# Altium project RK_MEGAPLATA.PrjPcb (part 6 of 9)
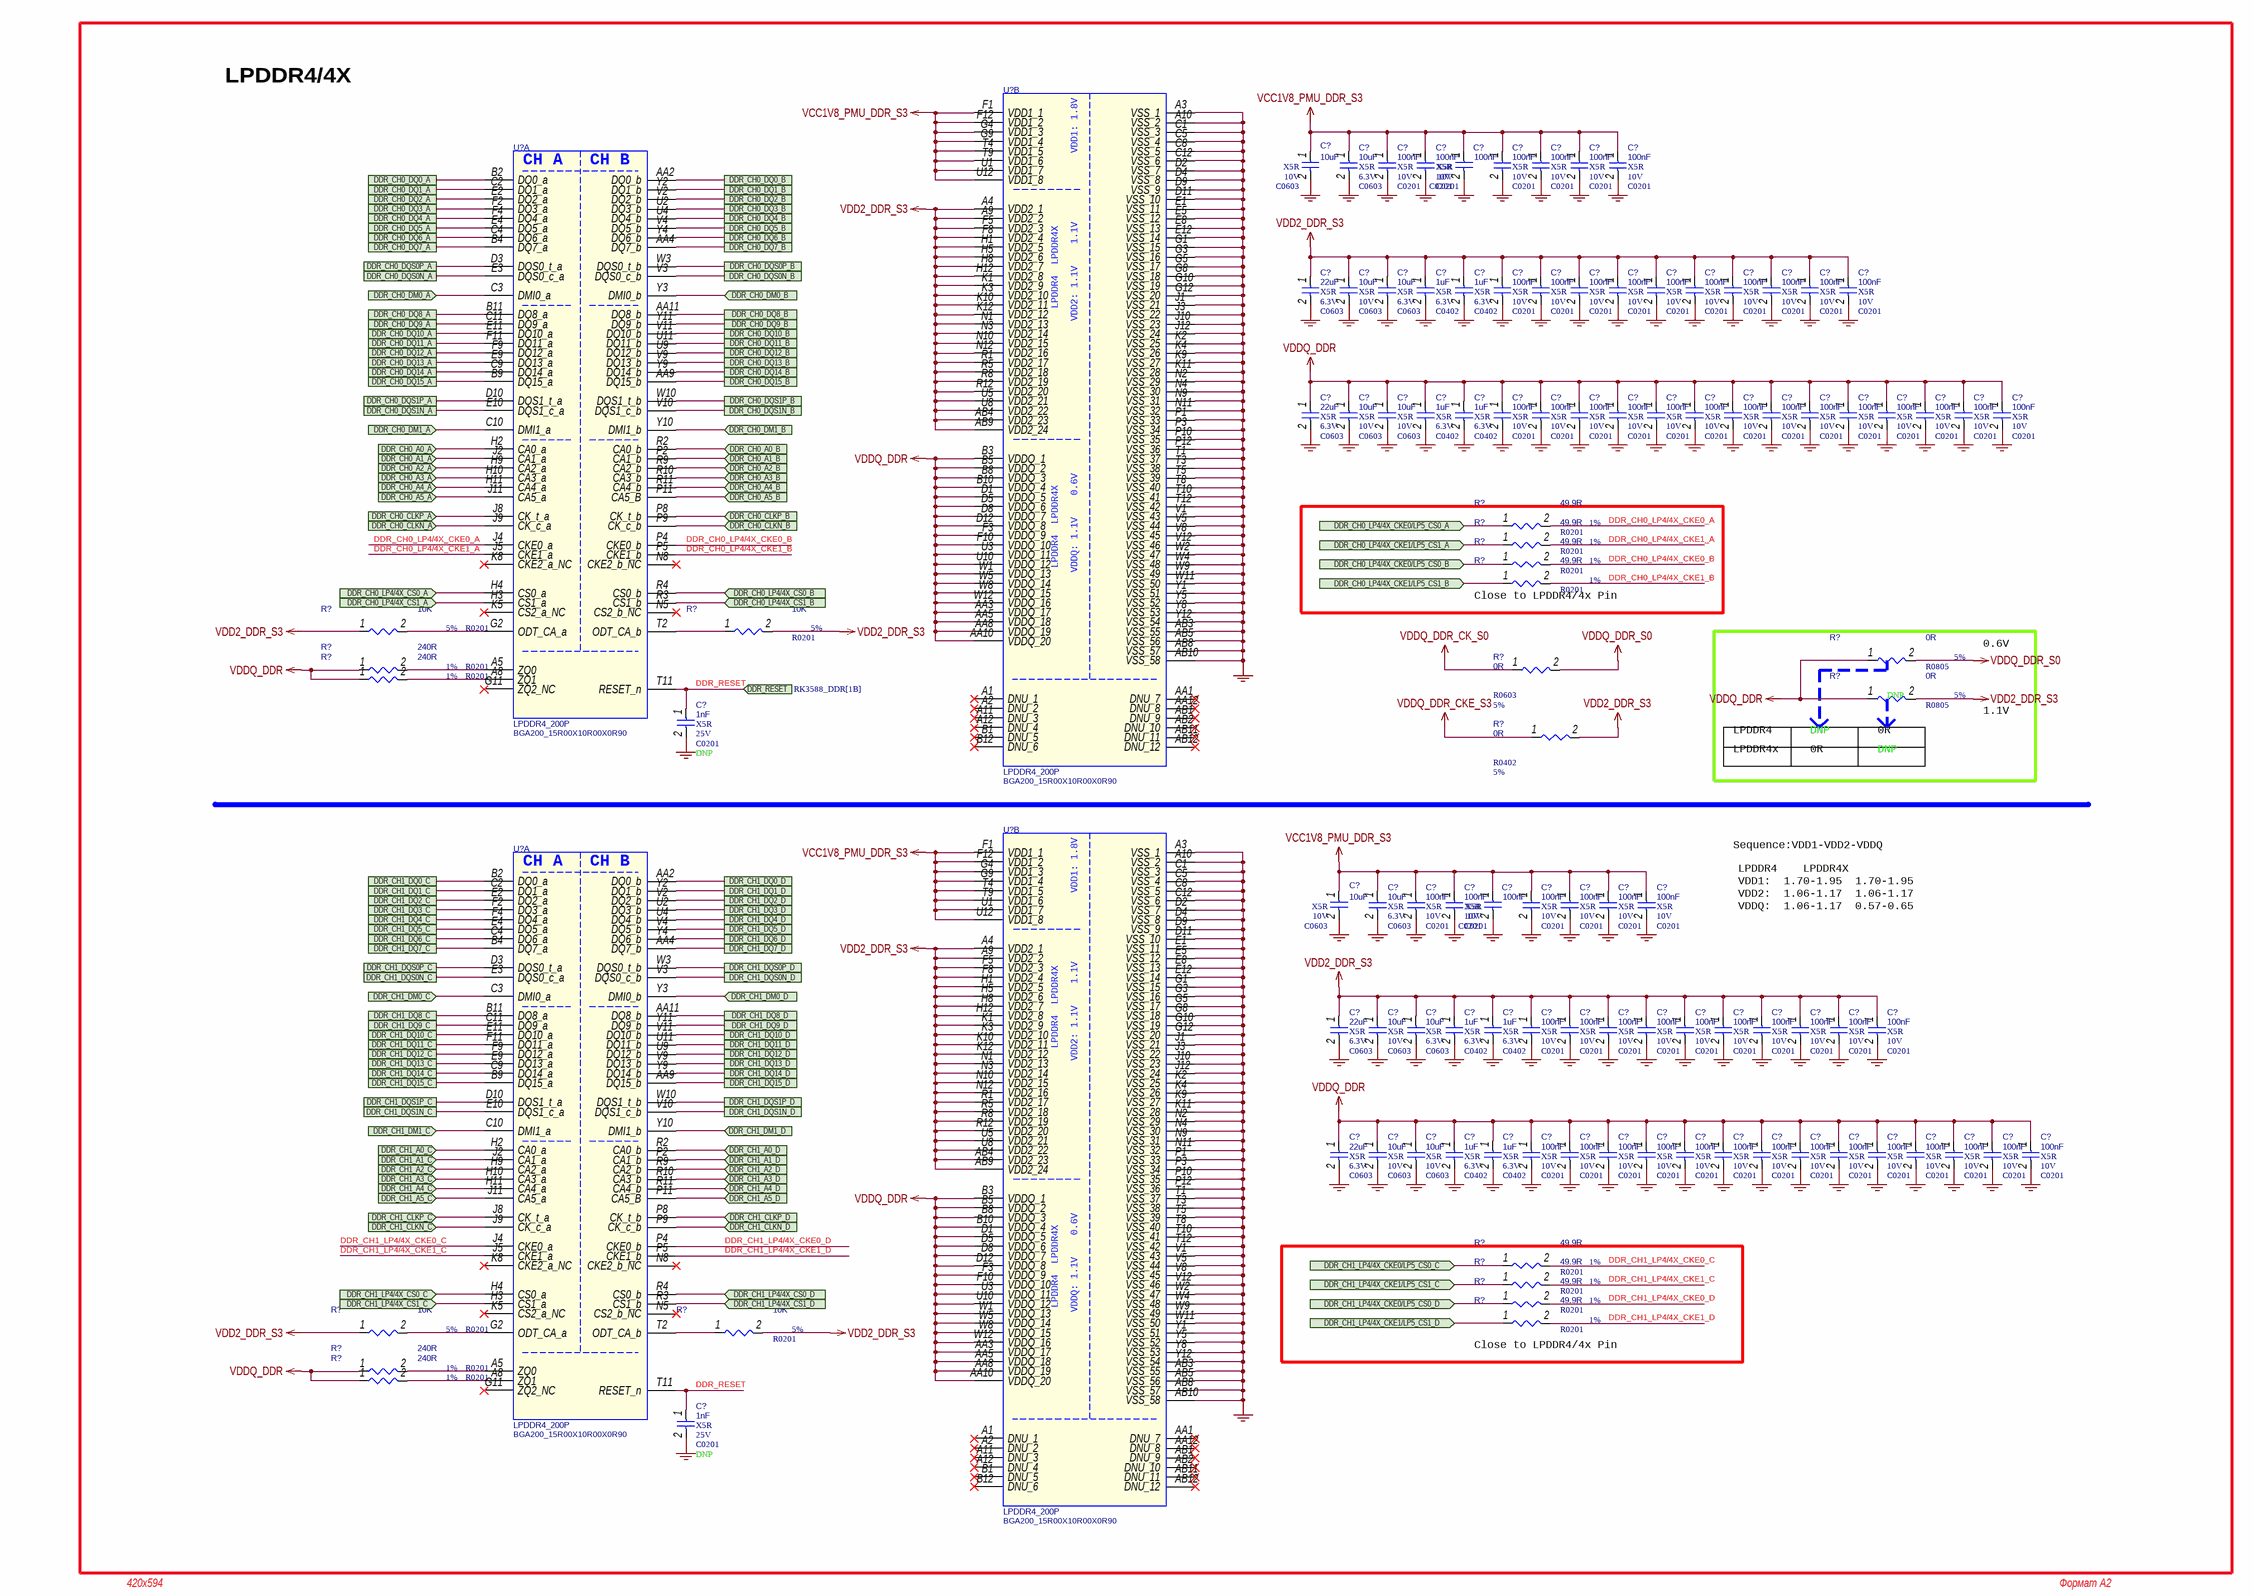
[diagram p28: DRAM_LPDDR4X_200P_2X32bit.SchDoc]

## Sheet DRAM_LPDDR4X_200P_2X32bit.SchDoc (continued)

### Library data of the parts
C?#200 = CAP NP_Dup1: cap,10.00uF,+/-10%,10V,X5R,C0603; Part Reference: C3800; Manufacturer PN: C1608X5R1A106K080AC; Manufacturer: TDK; C_Voltage: 6.3V; Tolerance: 10%; Priority: A; Number: 37; PCB Footprint: C0603; Value: 10uF; Created by: JJJ; Part Type: C0603; RK PN: C1608X5R1A106K080AC
C?#201 = CAP NP_Dup1: cap,10.00uF,+/-10%,6.3V,X5R,C0603; Part Reference: C3801; Manufacturer PN: C1608X5R0J106K080AB; Manufacturer: TDK; Tolerance: 10%; Priority: A; PCB Footprint: C0603; Value: 10uF; Created by: JJJ; Part Type: C0603; RK PN: C1608X5R0J106K080AB
C?#202 = CAP NP_Dup1: cap,100.00nF,+/-10%,10V,X5R,C0201; Part Reference: C3802; Manufacturer: TDK; RK PN: C0603X5R1A104K030BC; Priority: A; Tolerance: 10%; PCB Footprint: C0201; Value: 100nF; Part Type: C0201; Manufacturer PN: C0603X5R1A104K030BC; Created by: JJJ
C?#203 = CAP NP_Dup1: cap,100.00nF,+/-10%,10V,X5R,C0201; Part Reference: C3803; Manufacturer PN: C0603X5R1A104K030BC; Manufacturer: TDK; Tolerance: 10%; Priority: A; PCB Footprint: C0201; Value: 100nF; Created by: JJJ; Part Type: C0201; RK PN: C0603X5R1A104K030BC
C?#204 = CAP NP_Dup1: cap,100.00nF,+/-10%,10V,X5R,C0201; Part Reference: C3804; Manufacturer: TDK; Number: 37; RK PN: C0603X5R1A104K030BC; Priority: A; Tolerance: 10%; C_Voltage: 6.3V; PCB Footprint: C0201; Value: 100nF; Part Type: C0201; Manufacturer PN: C0603X5R1A104K030BC; Created by: JJJ
C?#205 = CAP NP_Dup1: cap,100.00nF,+/-10%,10V,X5R,C0201; Part Reference: C3805; Manufacturer: TDK; RK PN: C0603X5R1A104K030BC; Priority: A; Tolerance: 10%; PCB Footprint: C0201; Value: 100nF; Part Type: C0201; Manufacturer PN: C0603X5R1A104K030BC; Created by: JJJ
C?#206 = CAP NP_Dup1: cap,100.00nF,+/-10%,10V,X5R,C0201; Part Reference: C3806; Manufacturer: TDK; RK PN: C0603X5R1A104K030BC; Priority: A; Tolerance: 10%; PCB Footprint: C0201; Value: 100nF; Part Type: C0201; Manufacturer PN: C0603X5R1A104K030BC; Created by: JJJ
C?#207 = CAP NP_Dup1: cap,100.00nF,+/-10%,10V,X5R,C0201; Part Reference: C3807; Manufacturer PN: C0603X5R1A104K030BC; Manufacturer: TDK; Tolerance: 10%; Priority: A; PCB Footprint: C0201; Value: 100nF; Created by: JJJ; Part Type: C0201; RK PN: C0603X5R1A104K030BC
C?#208 = CAP NP_Dup1: cap,100.00nF,+/-10%,10V,X5R,C0201; Part Reference: C3808; Manufacturer PN: C0603X5R1A104K030BC; Manufacturer: TDK; Tolerance: 10%; Priority: A; PCB Footprint: C0201; Value: 100nF; Created by: JJJ; Part Type: C0201; RK PN: C0603X5R1A104K030BC
C?#209 = CAP NP_Dup1: cap,22.00uF,+/-20%,6.3V,X5R,C0603; Part Reference: C3809; Manufacturer PN: C1608X5R0J226M080AC; Manufacturer: TDK; Tolerance: 20%; Priority: A; PCB Footprint: C0603; Value: 22uF; Created by: JJJ; C_Voltage: 6.3V; Part Type: C0603; RK PN: C1608X5R0J226M080AC
C?#210 = CAP NP_Dup1: cap,10.00uF,+/-10%,10V,X5R,C0603; Part Reference: C3810; Manufacturer PN: C1608X5R1A106K080AC; Manufacturer: TDK; Tolerance: 10%; C_Voltage: 6.3V; Priority: A; PCB Footprint: C0603; Value: 10uF; Created by: JJJ; Part Type: C0603; RK PN: C1608X5R1A106K080AC
C?#211 = CAP NP_Dup1: cap,10.00uF,+/-10%,6.3V,X5R,C0603; Part Reference: C3811; Manufacturer PN: C1608X5R0J106K080AB; Manufacturer: TDK; Tolerance: 10%; Priority: A; PCB Footprint: C0603; Value: 10uF; Created by: JJJ; Part Type: C0603; RK PN: C1608X5R0J106K080AB
C?#212 = CAP NP_Dup1: cap,1.00uF,+/-10%,6.3V,X5R,C0402; Part Reference: C3812; Manufacturer PN: C1005X5R0J105K050BB; Manufacturer: TDK; Tolerance: 10%; Priority: A; PCB Footprint: C0402; Value: 1uF; Created by: JJJ; Part Type: C0402; RK PN: C1005X5R0J105K050BB
C?#213 = CAP NP_Dup1: cap,1.00uF,+/-10%,6.3V,X5R,C0402; Part Reference: C3813; Manufacturer PN: C1005X5R0J105K050BB; Manufacturer: TDK; Tolerance: 10%; Priority: A; PCB Footprint: C0402; Value: 1uF; Created by: JJJ; Part Type: C0402; RK PN: C1005X5R0J105K050BB
C?#214 = CAP NP_Dup1: cap,100.00nF,+/-10%,10V,X5R,C0201; Part Reference: C3814; Manufacturer PN: C0603X5R1A104K030BC; Manufacturer: TDK; Tolerance: 10%; Priority: A; PCB Footprint: C0201; Value: 100nF; Created by: JJJ; Part Type: C0201; RK PN: C0603X5R1A104K030BC
C?#215 = CAP NP_Dup1: cap,100.00nF,+/-10%,10V,X5R,C0201; Part Reference: C3815; Manufacturer PN: C0603X5R1A104K030BC; Manufacturer: TDK; Tolerance: 10%; Priority: A; PCB Footprint: C0201; Value: 100nF; Created by: JJJ; Part Type: C0201; RK PN: C0603X5R1A104K030BC
C?#216 = CAP NP_Dup1: cap,100.00nF,+/-10%,10V,X5R,C0201; Part Reference: C3816; Manufacturer: TDK; RK PN: C0603X5R1A104K030BC; Priority: A; Tolerance: 10%; PCB Footprint: C0201; Value: 100nF; Part Type: C0201; Manufacturer PN: C0603X5R1A104K030BC; Created by: JJJ
C?#217 = CAP NP_Dup1: cap,100.00nF,+/-10%,10V,X5R,C0201; Part Reference: C3817; Manufacturer PN: C0603X5R1A104K030BC; Manufacturer: TDK; Tolerance: 10%; Priority: A; PCB Footprint: C0201; Value: 100nF; Created by: JJJ; Part Type: C0201; RK PN: C0603X5R1A104K030BC
C?#218 = CAP NP_Dup1: cap,100.00nF,+/-10%,10V,X5R,C0201; Part Reference: C3818; Manufacturer PN: C0603X5R1A104K030BC; Manufacturer: TDK; Tolerance: 10%; Priority: A; PCB Footprint: C0201; Value: 100nF; Created by: JJJ; Part Type: C0201; RK PN: C0603X5R1A104K030BC
C?#219 = CAP NP_Dup1: cap,100.00nF,+/-10%,10V,X5R,C0201; Part Reference: C3819; Manufacturer: TDK; RK PN: C0603X5R1A104K030BC; Priority: A; Tolerance: 10%; PCB Footprint: C0201; Value: 100nF; Part Type: C0201; Manufacturer PN: C0603X5R1A104K030BC; Created by: JJJ
C?#220 = CAP NP_Dup1: cap,100.00nF,+/-10%,10V,X5R,C0201; Part Reference: C3820; Manufacturer: TDK; RK PN: C0603X5R1A104K030BC; Priority: A; Tolerance: 10%; PCB Footprint: C0201; Value: 100nF; Part Type: C0201; Manufacturer PN: C0603X5R1A104K030BC; Created by: JJJ
C?#221 = CAP NP_Dup1: cap,100.00nF,+/-10%,10V,X5R,C0201; Part Reference: C3821; Manufacturer PN: C0603X5R1A104K030BC; Manufacturer: TDK; Tolerance: 10%; Priority: A; PCB Footprint: C0201; Value: 100nF; Created by: JJJ; Part Type: C0201; RK PN: C0603X5R1A104K030BC
C?#222 = CAP NP_Dup1: cap,100.00nF,+/-10%,10V,X5R,C0201; Part Reference: C3822; Manufacturer: TDK; RK PN: C0603X5R1A104K030BC; Priority: A; Tolerance: 10%; PCB Footprint: C0201; Value: 100nF; Part Type: C0201; Manufacturer PN: C0603X5R1A104K030BC; Created by: JJJ
C?#223 = CAP NP_Dup1: cap,100.00nF,+/-10%,10V,X5R,C0201; Part Reference: C3823; Manufacturer PN: C0603X5R1A104K030BC; Manufacturer: TDK; Tolerance: 10%; Priority: A; PCB Footprint: C0201; Value: 100nF; Created by: JJJ; Part Type: C0201; RK PN: C0603X5R1A104K030BC
C?#224 = CAP NP_Dup1: cap,22.00uF,+/-20%,6.3V,X5R,C0603; Part Reference: C3824; Manufacturer: TDK; RK PN: C1608X5R0J226M080AC; Priority: A; Tolerance: 20%; PCB Footprint: C0603; Value: 22uF; Part Type: C0603; C_Voltage: 6.3V; Manufacturer PN: C1608X5R0J226M080AC; Created by: JJJ
C?#225 = CAP NP_Dup1: cap,10.00uF,+/-10%,10V,X5R,C0603; Part Reference: C3825; Manufacturer PN: C1608X5R1A106K080AC; Manufacturer: TDK; Tolerance: 10%; C_Voltage: 6.3V; Priority: A; PCB Footprint: C0603; Value: 10uF; Created by: JJJ; Part Type: C0603; RK PN: C1608X5R1A106K080AC
C?#226 = CAP NP_Dup1: cap,10.00uF,+/-10%,10V,X5R,C0603; Part Reference: C3826; Manufacturer: TDK; RK PN: C1608X5R1A106K080AC; Priority: A; C_Voltage: 6.3V; Tolerance: 10%; PCB Footprint: C0603; Value: 10uF; Part Type: C0603; Manufacturer PN: C1608X5R1A106K080AC; Created by: JJJ
C?#227 = CAP NP_Dup1: cap,1.00uF,+/-10%,6.3V,X5R,C0402; Part Reference: C3827; Manufacturer: TDK; RK PN: C1005X5R0J105K050BB; Priority: A; Tolerance: 10%; PCB Footprint: C0402; Value: 1uF; Part Type: C0402; Manufacturer PN: C1005X5R0J105K050BB; Created by: JJJ
C?#228 = CAP NP_Dup1: cap,1.00uF,+/-10%,6.3V,X5R,C0402; Part Reference: C3828; Manufacturer: TDK; RK PN: C1005X5R0J105K050BB; Priority: A; Tolerance: 10%; PCB Footprint: C0402; Value: 1uF; Part Type: C0402; Manufacturer PN: C1005X5R0J105K050BB; Created by: JJJ
C?#229 = CAP NP_Dup1: cap,100.00nF,+/-10%,10V,X5R,C0201; Part Reference: C3829; Manufacturer: TDK; RK PN: C0603X5R1A104K030BC; Priority: A; Tolerance: 10%; PCB Footprint: C0201; Value: 100nF; Part Type: C0201; Manufacturer PN: C0603X5R1A104K030BC; Created by: JJJ
C?#230 = CAP NP_Dup1: cap,100.00nF,+/-10%,10V,X5R,C0201; Part Reference: C3830; Manufacturer: TDK; RK PN: C0603X5R1A104K030BC; Priority: A; Tolerance: 10%; PCB Footprint: C0201; Value: 100nF; Part Type: C0201; Manufacturer PN: C0603X5R1A104K030BC; Created by: JJJ
C?#231 = CAP NP_Dup1: cap,100.00nF,+/-10%,10V,X5R,C0201; Part Reference: C3831; Manufacturer: TDK; RK PN: C0603X5R1A104K030BC; Priority: A; Tolerance: 10%; PCB Footprint: C0201; Value: 100nF; Part Type: C0201; Manufacturer PN: C0603X5R1A104K030BC; Created by: JJJ
C?#232 = CAP NP_Dup1: cap,100.00nF,+/-10%,10V,X5R,C0201; Part Reference: C3832; Manufacturer PN: C0603X5R1A104K030BC; Manufacturer: TDK; Tolerance: 10%; Priority: A; PCB Footprint: C0201; Value: 100nF; Created by: JJJ; Part Type: C0201; RK PN: C0603X5R1A104K030BC
C?#233 = CAP NP_Dup1: cap,100.00nF,+/-10%,10V,X5R,C0201; Part Reference: C3833; Manufacturer PN: C0603X5R1A104K030BC; Manufacturer: TDK; Tolerance: 10%; Priority: A; PCB Footprint: C0201; Value: 100nF; Created by: JJJ; Part Type: C0201; RK PN: C0603X5R1A104K030BC
C?#234 = CAP NP_Dup1: cap,100.00nF,+/-10%,10V,X5R,C0201; Part Reference: C3834; Manufacturer PN: C0603X5R1A104K030BC; Manufacturer: TDK; Tolerance: 10%; Priority: A; PCB Footprint: C0201; Value: 100nF; Created by: JJJ; Part Type: C0201; RK PN: C0603X5R1A104K030BC
C?#235 = CAP NP_Dup1: cap,100.00nF,+/-10%,10V,X5R,C0201; Part Reference: C3835; Manufacturer: TDK; RK PN: C0603X5R1A104K030BC; Priority: A; Tolerance: 10%; PCB Footprint: C0201; Value: 100nF; Part Type: C0201; Manufacturer PN: C0603X5R1A104K030BC; Created by: JJJ
C?#236 = CAP NP_Dup1: cap,100.00nF,+/-10%,10V,X5R,C0201; Part Reference: C3836; Manufacturer PN: C0603X5R1A104K030BC; Manufacturer: TDK; Tolerance: 10%; Priority: A; PCB Footprint: C0201; Value: 100nF; Created by: JJJ; Part Type: C0201; RK PN: C0603X5R1A104K030BC
C?#237 = CAP NP_Dup1: cap,100.00nF,+/-10%,10V,X5R,C0201; Part Reference: C3837; Manufacturer PN: C0603X5R1A104K030BC; Manufacturer: TDK; Tolerance: 10%; Priority: A; PCB Footprint: C0201; Value: 100nF; Created by: JJJ; Part Type: C0201; RK PN: C0603X5R1A104K030BC
C?#238 = CAP NP_Dup1: cap,100.00nF,+/-10%,10V,X5R,C0201; Part Reference: C3838; Manufacturer: TDK; RK PN: C0603X5R1A104K030BC; Priority: A; Tolerance: 10%; PCB Footprint: C0201; Value: 100nF; Part Type: C0201; Manufacturer PN: C0603X5R1A104K030BC; Created by: JJJ
C?#239 = CAP NP_Dup1: cap,100.00nF,+/-10%,10V,X5R,C0201; Part Reference: C3839; Manufacturer PN: C0603X5R1A104K030BC; Manufacturer: TDK; Tolerance: 10%; Priority: A; PCB Footprint: C0201; Value: 100nF; Created by: JJJ; Part Type: C0201; RK PN: C0603X5R1A104K030BC
C?#240 = CAP NP_Dup1: cap,100.00nF,+/-10%,10V,X5R,C0201; Part Reference: C3840; Manufacturer: TDK; RK PN: C0603X5R1A104K030BC; Priority: A; Tolerance: 10%; PCB Footprint: C0201; Value: 100nF; Part Type: C0201; Manufacturer PN: C0603X5R1A104K030BC; Created by: JJJ
C?#241 = CAP NP_Dup1: cap,100.00nF,+/-10%,10V,X5R,C0201; Part Reference: C3841; Manufacturer: TDK; RK PN: C0603X5R1A104K030BC; Priority: A; Tolerance: 10%; PCB Footprint: C0201; Value: 100nF; Part Type: C0201; Manufacturer PN: C0603X5R1A104K030BC; Created by: JJJ
C?#242 = CAP NP_Dup1: cap,100.00nF,+/-10%,10V,X5R,C0201; Part Reference: C3842; Manufacturer: TDK; RK PN: C0603X5R1A104K030BC; Priority: A; Tolerance: 10%; PCB Footprint: C0201; Value: 100nF; Part Type: C0201; Manufacturer PN: C0603X5R1A104K030BC; Created by: JJJ
C?#243 = CAP NP_Dup1: cap,1.00nF,+/-10%,25V,X5R,C0201; Part Reference: C3844; Manufacturer: TDK; RK PN: C0603X5R1E102K030BA; Priority: A; Tolerance: 10%; PCB Footprint: C0201; Value: 1nF; Part Type: C0201; Manufacturer PN: C0603X5R1E102K030BA; Created by: JJJ
C?#244 = CAP NP_Dup1: cap,10.00uF,+/-10%,10V,X5R,C0603; Part Reference: C3845; Manufacturer PN: C1608X5R1A106K080AC; Manufacturer: TDK; C_Voltage: 6.3V; Tolerance: 10%; Priority: A; Number: 37; PCB Footprint: C0603; Value: 10uF; Created by: JJJ; Part Type: C0603; RK PN: C1608X5R1A106K080AC
C?#245 = CAP NP_Dup1: cap,10.00uF,+/-10%,6.3V,X5R,C0603; Part Reference: C3846; Manufacturer PN: C1608X5R0J106K080AB; Manufacturer: TDK; Tolerance: 10%; Priority: A; PCB Footprint: C0603; Value: 10uF; Created by: JJJ; Part Type: C0603; RK PN: C1608X5R0J106K080AB
C?#246 = CAP NP_Dup1: cap,100.00nF,+/-10%,10V,X5R,C0201; Part Reference: C3847; Manufacturer: TDK; RK PN: C0603X5R1A104K030BC; Priority: A; Tolerance: 10%; PCB Footprint: C0201; Value: 100nF; Part Type: C0201; Manufacturer PN: C0603X5R1A104K030BC; Created by: JJJ
C?#247 = CAP NP_Dup1: cap,100.00nF,+/-10%,10V,X5R,C0201; Part Reference: C3848; Manufacturer PN: C0603X5R1A104K030BC; Manufacturer: TDK; Tolerance: 10%; Priority: A; PCB Footprint: C0201; Value: 100nF; Created by: JJJ; Part Type: C0201; RK PN: C0603X5R1A104K030BC
C?#248 = CAP NP_Dup1: cap,100.00nF,+/-10%,10V,X5R,C0201; Part Reference: C3849; Manufacturer: TDK; Number: 37; RK PN: C0603X5R1A104K030BC; Priority: A; Tolerance: 10%; C_Voltage: 6.3V; PCB Footprint: C0201; Value: 100nF; Part Type: C0201; Manufacturer PN: C0603X5R1A104K030BC; Created by: JJJ
C?#249 = CAP NP_Dup1: cap,100.00nF,+/-10%,10V,X5R,C0201; Part Reference: C3850; Manufacturer: TDK; RK PN: C0603X5R1A104K030BC; Priority: A; Tolerance: 10%; PCB Footprint: C0201; Value: 100nF; Part Type: C0201; Manufacturer PN: C0603X5R1A104K030BC; Created by: JJJ
C?#250 = CAP NP_Dup1: cap,100.00nF,+/-10%,10V,X5R,C0201; Part Reference: C3851; Manufacturer: TDK; RK PN: C0603X5R1A104K030BC; Priority: A; Tolerance: 10%; PCB Footprint: C0201; Value: 100nF; Part Type: C0201; Manufacturer PN: C0603X5R1A104K030BC; Created by: JJJ
C?#251 = CAP NP_Dup1: cap,100.00nF,+/-10%,10V,X5R,C0201; Part Reference: C3852; Manufacturer PN: C0603X5R1A104K030BC; Manufacturer: TDK; Tolerance: 10%; Priority: A; PCB Footprint: C0201; Value: 100nF; Created by: JJJ; Part Type: C0201; RK PN: C0603X5R1A104K030BC
C?#252 = CAP NP_Dup1: cap,100.00nF,+/-10%,10V,X5R,C0201; Part Reference: C3853; Manufacturer PN: C0603X5R1A104K030BC; Manufacturer: TDK; Tolerance: 10%; Priority: A; PCB Footprint: C0201; Value: 100nF; Created by: JJJ; Part Type: C0201; RK PN: C0603X5R1A104K030BC
C?#253 = CAP NP_Dup1: cap,22.00uF,+/-20%,6.3V,X5R,C0603; Part Reference: C3854; Manufacturer PN: C1608X5R0J226M080AC; Manufacturer: TDK; Tolerance: 20%; Priority: A; PCB Footprint: C0603; Value: 22uF; Created by: JJJ; C_Voltage: 6.3V; Part Type: C0603; RK PN: C1608X5R0J226M080AC
C?#254 = CAP NP_Dup1: cap,10.00uF,+/-10%,10V,X5R,C0603; Part Reference: C3855; Manufacturer PN: C1608X5R1A106K080AC; Manufacturer: TDK; Tolerance: 10%; C_Voltage: 6.3V; Priority: A; PCB Footprint: C0603; Value: 10uF; Created by: JJJ; Part Type: C0603; RK PN: C1608X5R1A106K080AC
C?#255 = CAP NP_Dup1: cap,10.00uF,+/-10%,6.3V,X5R,C0603; Part Reference: C3856; Manufacturer PN: C1608X5R0J106K080AB; Manufacturer: TDK; Tolerance: 10%; Priority: A; PCB Footprint: C0603; Value: 10uF; Created by: JJJ; Part Type: C0603; RK PN: C1608X5R0J106K080AB
C?#256 = CAP NP_Dup1: cap,1.00uF,+/-10%,6.3V,X5R,C0402; Part Reference: C3857; Manufacturer PN: C1005X5R0J105K050BB; Manufacturer: TDK; Tolerance: 10%; Priority: A; PCB Footprint: C0402; Value: 1uF; Created by: JJJ; Part Type: C0402; RK PN: C1005X5R0J105K050BB
C?#257 = CAP NP_Dup1: cap,1.00uF,+/-10%,6.3V,X5R,C0402; Part Reference: C3858; Manufacturer PN: C1005X5R0J105K050BB; Manufacturer: TDK; Tolerance: 10%; Priority: A; PCB Footprint: C0402; Value: 1uF; Created by: JJJ; Part Type: C0402; RK PN: C1005X5R0J105K050BB
C?#258 = CAP NP_Dup1: cap,100.00nF,+/-10%,10V,X5R,C0201; Part Reference: C3859; Manufacturer PN: C0603X5R1A104K030BC; Manufacturer: TDK; Tolerance: 10%; Priority: A; PCB Footprint: C0201; Value: 100nF; Created by: JJJ; Part Type: C0201; RK PN: C0603X5R1A104K030BC
C?#259 = CAP NP_Dup1: cap,100.00nF,+/-10%,10V,X5R,C0201; Part Reference: C3860; Manufacturer PN: C0603X5R1A104K030BC; Manufacturer: TDK; Tolerance: 10%; Priority: A; PCB Footprint: C0201; Value: 100nF; Created by: JJJ; Part Type: C0201; RK PN: C0603X5R1A104K030BC
C?#260 = CAP NP_Dup1: cap,100.00nF,+/-10%,10V,X5R,C0201; Part Reference: C3861; Manufacturer: TDK; RK PN: C0603X5R1A104K030BC; Priority: A; Tolerance: 10%; PCB Footprint: C0201; Value: 100nF; Part Type: C0201; Manufacturer PN: C0603X5R1A104K030BC; Created by: JJJ
C?#261 = CAP NP_Dup1: cap,100.00nF,+/-10%,10V,X5R,C0201; Part Reference: C3862; Manufacturer PN: C0603X5R1A104K030BC; Manufacturer: TDK; Tolerance: 10%; Priority: A; PCB Footprint: C0201; Value: 100nF; Created by: JJJ; Part Type: C0201; RK PN: C0603X5R1A104K030BC
C?#262 = CAP NP_Dup1: cap,100.00nF,+/-10%,10V,X5R,C0201; Part Reference: C3863; Manufacturer PN: C0603X5R1A104K030BC; Manufacturer: TDK; Tolerance: 10%; Priority: A; PCB Footprint: C0201; Value: 100nF; Created by: JJJ; Part Type: C0201; RK PN: C0603X5R1A104K030BC
C?#263 = CAP NP_Dup1: cap,100.00nF,+/-10%,10V,X5R,C0201; Part Reference: C3864; Manufacturer: TDK; RK PN: C0603X5R1A104K030BC; Priority: A; Tolerance: 10%; PCB Footprint: C0201; Value: 100nF; Part Type: C0201; Manufacturer PN: C0603X5R1A104K030BC; Created by: JJJ
C?#264 = CAP NP_Dup1: cap,100.00nF,+/-10%,10V,X5R,C0201; Part Reference: C3865; Manufacturer: TDK; RK PN: C0603X5R1A104K030BC; Priority: A; Tolerance: 10%; PCB Footprint: C0201; Value: 100nF; Part Type: C0201; Manufacturer PN: C0603X5R1A104K030BC; Created by: JJJ
C?#265 = CAP NP_Dup1: cap,100.00nF,+/-10%,10V,X5R,C0201; Part Reference: C3866; Manufacturer PN: C0603X5R1A104K030BC; Manufacturer: TDK; Tolerance: 10%; Priority: A; PCB Footprint: C0201; Value: 100nF; Created by: JJJ; Part Type: C0201; RK PN: C0603X5R1A104K030BC
C?#266 = CAP NP_Dup1: cap,100.00nF,+/-10%,10V,X5R,C0201; Part Reference: C3867; Manufacturer: TDK; RK PN: C0603X5R1A104K030BC; Priority: A; Tolerance: 10%; PCB Footprint: C0201; Value: 100nF; Part Type: C0201; Manufacturer PN: C0603X5R1A104K030BC; Created by: JJJ
C?#267 = CAP NP_Dup1: cap,100.00nF,+/-10%,10V,X5R,C0201; Part Reference: C3868; Manufacturer PN: C0603X5R1A104K030BC; Manufacturer: TDK; Tolerance: 10%; Priority: A; PCB Footprint: C0201; Value: 100nF; Created by: JJJ; Part Type: C0201; RK PN: C0603X5R1A104K030BC
C?#268 = CAP NP_Dup1: cap,22.00uF,+/-20%,6.3V,X5R,C0603; Part Reference: C3869; Manufacturer: TDK; RK PN: C1608X5R0J226M080AC; Priority: A; Tolerance: 20%; PCB Footprint: C0603; Value: 22uF; Part Type: C0603; C_Voltage: 6.3V; Manufacturer PN: C1608X5R0J226M080AC; Created by: JJJ
C?#269 = CAP NP_Dup1: cap,10.00uF,+/-10%,10V,X5R,C0603; Part Reference: C3870; Manufacturer PN: C1608X5R1A106K080AC; Manufacturer: TDK; Tolerance: 10%; C_Voltage: 6.3V; Priority: A; PCB Footprint: C0603; Value: 10uF; Created by: JJJ; Part Type: C0603; RK PN: C1608X5R1A106K080AC
C?#270 = CAP NP_Dup1: cap,10.00uF,+/-10%,10V,X5R,C0603; Part Reference: C3871; Manufacturer: TDK; RK PN: C1608X5R1A106K080AC; Priority: A; C_Voltage: 6.3V; Tolerance: 10%; PCB Footprint: C0603; Value: 10uF; Part Type: C0603; Manufacturer PN: C1608X5R1A106K080AC; Created by: JJJ
C?#271 = CAP NP_Dup1: cap,1.00uF,+/-10%,6.3V,X5R,C0402; Part Reference: C3872; Manufacturer: TDK; RK PN: C1005X5R0J105K050BB; Priority: A; Tolerance: 10%; PCB Footprint: C0402; Value: 1uF; Part Type: C0402; Manufacturer PN: C1005X5R0J105K050BB; Created by: JJJ
C?#272 = CAP NP_Dup1: cap,1.00uF,+/-10%,6.3V,X5R,C0402; Part Reference: C3873; Manufacturer: TDK; RK PN: C1005X5R0J105K050BB; Priority: A; Tolerance: 10%; PCB Footprint: C0402; Value: 1uF; Part Type: C0402; Manufacturer PN: C1005X5R0J105K050BB; Created by: JJJ
C?#273 = CAP NP_Dup1: cap,100.00nF,+/-10%,10V,X5R,C0201; Part Reference: C3874; Manufacturer: TDK; RK PN: C0603X5R1A104K030BC; Priority: A; Tolerance: 10%; PCB Footprint: C0201; Value: 100nF; Part Type: C0201; Manufacturer PN: C0603X5R1A104K030BC; Created by: JJJ
C?#274 = CAP NP_Dup1: cap,100.00nF,+/-10%,10V,X5R,C0201; Part Reference: C3875; Manufacturer: TDK; RK PN: C0603X5R1A104K030BC; Priority: A; Tolerance: 10%; PCB Footprint: C0201; Value: 100nF; Part Type: C0201; Manufacturer PN: C0603X5R1A104K030BC; Created by: JJJ
C?#275 = CAP NP_Dup1: cap,100.00nF,+/-10%,10V,X5R,C0201; Part Reference: C3876; Manufacturer: TDK; RK PN: C0603X5R1A104K030BC; Priority: A; Tolerance: 10%; PCB Footprint: C0201; Value: 100nF; Part Type: C0201; Manufacturer PN: C0603X5R1A104K030BC; Created by: JJJ
C?#276 = CAP NP_Dup1: cap,100.00nF,+/-10%,10V,X5R,C0201; Part Reference: C3877; Manufacturer PN: C0603X5R1A104K030BC; Manufacturer: TDK; Tolerance: 10%; Priority: A; PCB Footprint: C0201; Value: 100nF; Created by: JJJ; Part Type: C0201; RK PN: C0603X5R1A104K030BC
C?#277 = CAP NP_Dup1: cap,100.00nF,+/-10%,10V,X5R,C0201; Part Reference: C3878; Manufacturer PN: C0603X5R1A104K030BC; Manufacturer: TDK; Tolerance: 10%; Priority: A; PCB Footprint: C0201; Value: 100nF; Created by: JJJ; Part Type: C0201; RK PN: C0603X5R1A104K030BC
C?#278 = CAP NP_Dup1: cap,100.00nF,+/-10%,10V,X5R,C0201; Part Reference: C3879; Manufacturer PN: C0603X5R1A104K030BC; Manufacturer: TDK; Tolerance: 10%; Priority: A; PCB Footprint: C0201; Value: 100nF; Created by: JJJ; Part Type: C0201; RK PN: C0603X5R1A104K030BC
C?#279 = CAP NP_Dup1: cap,100.00nF,+/-10%,10V,X5R,C0201; Part Reference: C3880; Manufacturer: TDK; RK PN: C0603X5R1A104K030BC; Priority: A; Tolerance: 10%; PCB Footprint: C0201; Value: 100nF; Part Type: C0201; Manufacturer PN: C0603X5R1A104K030BC; Created by: JJJ
C?#280 = CAP NP_Dup1: cap,100.00nF,+/-10%,10V,X5R,C0201; Part Reference: C3881; Manufacturer PN: C0603X5R1A104K030BC; Manufacturer: TDK; Tolerance: 10%; Priority: A; PCB Footprint: C0201; Value: 100nF; Created by: JJJ; Part Type: C0201; RK PN: C0603X5R1A104K030BC
C?#281 = CAP NP_Dup1: cap,100.00nF,+/-10%,10V,X5R,C0201; Part Reference: C3882; Manufacturer PN: C0603X5R1A104K030BC; Manufacturer: TDK; Tolerance: 10%; Priority: A; PCB Footprint: C0201; Value: 100nF; Created by: JJJ; Part Type: C0201; RK PN: C0603X5R1A104K030BC
C?#282 = CAP NP_Dup1: cap,100.00nF,+/-10%,10V,X5R,C0201; Part Reference: C3883; Manufacturer: TDK; RK PN: C0603X5R1A104K030BC; Priority: A; Tolerance: 10%; PCB Footprint: C0201; Value: 100nF; Part Type: C0201; Manufacturer PN: C0603X5R1A104K030BC; Created by: JJJ
C?#283 = CAP NP_Dup1: cap,100.00nF,+/-10%,10V,X5R,C0201; Part Reference: C3884; Manufacturer PN: C0603X5R1A104K030BC; Manufacturer: TDK; Tolerance: 10%; Priority: A; PCB Footprint: C0201; Value: 100nF; Created by: JJJ; Part Type: C0201; RK PN: C0603X5R1A104K030BC
C?#284 = CAP NP_Dup1: cap,100.00nF,+/-10%,10V,X5R,C0201; Part Reference: C3885; Manufacturer: TDK; RK PN: C0603X5R1A104K030BC; Priority: A; Tolerance: 10%; PCB Footprint: C0201; Value: 100nF; Part Type: C0201; Manufacturer PN: C0603X5R1A104K030BC; Created by: JJJ
C?#285 = CAP NP_Dup1: cap,100.00nF,+/-10%,10V,X5R,C0201; Part Reference: C3886; Manufacturer: TDK; RK PN: C0603X5R1A104K030BC; Priority: A; Tolerance: 10%; PCB Footprint: C0201; Value: 100nF; Part Type: C0201; Manufacturer PN: C0603X5R1A104K030BC; Created by: JJJ
C?#286 = CAP NP_Dup1: cap,100.00nF,+/-10%,10V,X5R,C0201; Part Reference: C3887; Manufacturer: TDK; RK PN: C0603X5R1A104K030BC; Priority: A; Tolerance: 10%; PCB Footprint: C0201; Value: 100nF; Part Type: C0201; Manufacturer PN: C0603X5R1A104K030BC; Created by: JJJ
C?#287 = CAP NP_Dup1: cap,1.00nF,+/-10%,25V,X5R,C0201; Part Reference: C3888; Manufacturer: TDK; RK PN: C0603X5R1E102K030BA; Priority: A; Tolerance: 10%; PCB Footprint: C0201; Value: 1nF; Part Type: C0201; Manufacturer PN: C0603X5R1E102K030BA; Created by: JJJ
R?#85 = RESISTOR_Dup2: НЁУГєсД¤µзЧи,49R9,+/-1%,R0201,1/20W.; Part Reference: R3801; Manufacturer: YAGEO; RK PN: RC0201FR-0749R9L; Priority: A; Wattage: 1/20W; Value: 49.9R; Part Type: НЁУГєсД¤µзЧи; Manufacturer PN: RC0201FR-0749R9L; Created by: YTL
R?#86 = RESISTOR_Dup2: НЁУГєсД¤µзЧи,49R9,+/-1%,R0201,1/20W.; Part Reference: R3802; Manufacturer: YAGEO; Wattage: 1/20W; RK PN: RC0201FR-0749R9L; Priority: A; Value: 49.9R; Part Type: НЁУГєсД¤µзЧи; Manufacturer PN: RC0201FR-0749R9L; Created by: YTL
R?#87 = RESISTOR_Dup2: НЁУГєсД¤µзЧи,49R9,+/-1%,R0201,1/20W.; Part Reference: R3804; Manufacturer PN: RC0201FR-0749R9L; Manufacturer: YAGEO; Priority: A; Wattage: 1/20W; Value: 49.9R; Created by: YTL; Part Type: НЁУГєсД¤µзЧи; RK PN: RC0201FR-0749R9L
R?#88 = RESISTOR_Dup2: НЁУГєсД¤µзЧи,49R9,+/-1%,R0201,1/20W.; Part Reference: R3805; Manufacturer: YAGEO; Manufacturer PN: RC0201FR-0749R9L; Wattage: 1/20W; Priority: A; Value: 49.9R; Created by: YTL; Part Type: НЁУГєсД¤µзЧи; RK PN: RC0201FR-0749R9L
R?#89 = RESISTOR_Dup2: НЁУГєсД¤µзЧи,10K,+/-5%,R0201,1/20W.; Part Reference: R3806; Manufacturer: YAGEO; RK PN: RC0201JR-0710KL; Priority: A; Wattage: 1/20W; Value: 10K; Part Type: НЁУГєсД¤µзЧи; Manufacturer PN: RC0201JR-0710KL; Created by: YTL
R?#90 = RESISTOR_Dup2: НЁУГєсД¤µзЧи,10K,+/-5%,R0201,1/20W.; Part Reference: R3807; Manufacturer: YAGEO; RK PN: RC0201JR-0710KL; Priority: A; Wattage: 1/20W; Value: 10K; Part Type: НЁУГєсД¤µзЧи; Manufacturer PN: RC0201JR-0710KL; Created by: YTL
R?#91 = RESISTOR_Dup2: НЁУГєсД¤µзЧи,0R,+/-5%,R0805,1/8W.; Part Reference: R3808; Manufacturer PN: RC0805JR-070RL; Manufacturer: YAGEO; Wattage: 1/8W; Priority: A; Value: 0R; Created by: YTL; Part Type: НЁУГєсД¤µзЧи; RK PN: RC0805JR-070RL
R?#92 = RESISTOR_Dup2: НЁУГєсД¤µзЧи,240R,+/-1%,R0201,1/20W.; Part Reference: R3809; Manufacturer PN: RC0201FR-07240RL; Manufacturer: YAGEO; Wattage: 1/20W; Priority: A; Value: 240R; Created by: YTL; Part Type: НЁУГєсД¤µзЧи; RK PN: RC0201FR-07240RL
R?#93 = RESISTOR_Dup2: НЁУГєсД¤µзЧи,0R,+/-5%,R0603,1/10W.; Part Reference: R1204; Manufacturer: YAGEO; RK PN: RC0603JR-070RL; Priority: A; Wattage: 1/10W; Value: 0R; Part Type: НЁУГєсД¤µзЧи; Manufacturer PN: RC0603JR-070RL; Created by: YTL
R?#94 = RESISTOR_Dup2: НЁУГєсД¤µзЧи,240R,+/-1%,R0201,1/20W.; Part Reference: R3810; Manufacturer: YAGEO; RK PN: RC0201FR-07240RL; Priority: A; Wattage: 1/20W; Value: 240R; Part Type: НЁУГєсД¤µзЧи; Manufacturer PN: RC0201FR-07240RL; Created by: YTL
R?#95 = RESISTOR_Dup2: НЁУГєсД¤µзЧи,0R,+/-5%,R0805,1/8W.; Part Reference: R3811; Manufacturer: YAGEO; RK PN: RC0805JR-070RL; Priority: A; Wattage: 1/8W; Value: 0R; Part Type: НЁУГєсД¤µзЧи; Manufacturer PN: RC0805JR-070RL; Created by: YTL
R?#96 = RESISTOR_Dup2: НЁУГєсД¤µзЧи,0R,+/-5%,R0402,1/16W.; Part Reference: R1205; Manufacturer PN: RC0402JR-070RL; Manufacturer: YAGEO; Wattage: 1/16W; Priority: A; PCB Footprint: R0402; Value: 0R; Created by: YTL; Part Type: НЁУГєсД¤µзЧи; RK PN: RC0402JR-070RL
R?#97 = RESISTOR_Dup2: НЁУГєсД¤µзЧи,49R9,+/-1%,R0201,1/20W.; Part Reference: R3812; Manufacturer PN: RC0201FR-0749R9L; Manufacturer: YAGEO; Priority: A; Wattage: 1/20W; Value: 49.9R; Created by: YTL; Part Type: НЁУГєсД¤µзЧи; RK PN: RC0201FR-0749R9L
R?#98 = RESISTOR_Dup2: НЁУГєсД¤µзЧи,49R9,+/-1%,R0201,1/20W.; Part Reference: R3813; Manufacturer: YAGEO; RK PN: RC0201FR-0749R9L; Priority: A; Wattage: 1/20W; Value: 49.9R; Part Type: НЁУГєсД¤µзЧи; Manufacturer PN: RC0201FR-0749R9L; Created by: YTL
R?#99 = RESISTOR_Dup2: НЁУГєсД¤µзЧи,49R9,+/-1%,R0201,1/20W.; Part Reference: R3814; Manufacturer: YAGEO; RK PN: RC0201FR-0749R9L; Priority: A; Wattage: 1/20W; Value: 49.9R; Part Type: НЁУГєсД¤µзЧи; Manufacturer PN: RC0201FR-0749R9L; Created by: YTL
R?#100 = RESISTOR_Dup2: НЁУГєсД¤µзЧи,49R9,+/-1%,R0201,1/20W.; Part Reference: R3815; Manufacturer PN: RC0201FR-0749R9L; Manufacturer: YAGEO; Priority: A; Wattage: 1/20W; Value: 49.9R; Created by: YTL; Part Type: НЁУГєсД¤µзЧи; RK PN: RC0201FR-0749R9L
R?#101 = RESISTOR_Dup2: НЁУГєсД¤µзЧи,10K,+/-5%,R0201,1/20W.; Part Reference: R3816; Manufacturer PN: RC0201JR-0710KL; Manufacturer: YAGEO; Wattage: 1/20W; Priority: A; Value: 10K; Created by: YTL; Part Type: НЁУГєсД¤µзЧи; RK PN: RC0201JR-0710KL
R?#102 = RESISTOR_Dup2: НЁУГєсД¤µзЧи,10K,+/-5%,R0201,1/20W.; Part Reference: R3817; Manufacturer PN: RC0201JR-0710KL; Manufacturer: YAGEO; Wattage: 1/20W; Priority: A; Value: 10K; Created by: YTL; Part Type: НЁУГєсД¤µзЧи; RK PN: RC0201JR-0710KL
R?#103 = RESISTOR_Dup2: НЁУГєсД¤µзЧи,240R,+/-1%,R0201,1/20W.; Part Reference: R3818; Manufacturer PN: RC0201FR-07240RL; Manufacturer: YAGEO; Wattage: 1/20W; Priority: A; Value: 240R; Created by: YTL; Part Type: НЁУГєсД¤µзЧи; RK PN: RC0201FR-07240RL
R?#104 = RESISTOR_Dup2: НЁУГєсД¤µзЧи,240R,+/-1%,R0201,1/20W.; Part Reference: R3819; Manufacturer PN: RC0201FR-07240RL; Manufacturer: YAGEO; Wattage: 1/20W; Priority: A; Value: 240R; Created by: YTL; Part Type: НЁУГєсД¤µзЧи; RK PN: RC0201FR-07240RL
U?#34 U?#35 = LPDDR4_200P: Part Reference: U3800; PCB Footprint: BGA200_15R00X10R00X0R90; Value: LPDDR4_200P
U?#36 U?#37 = LPDDR4_200P: Part Reference: U3801; PCB Footprint: BGA200_15R00X10R00X0R90; Value: LPDDR4_200P

## Sheet FLASH_EMMC.SchDoc
size 420 x 297 mm; SheetNumber: 17; SheetTotal: 23
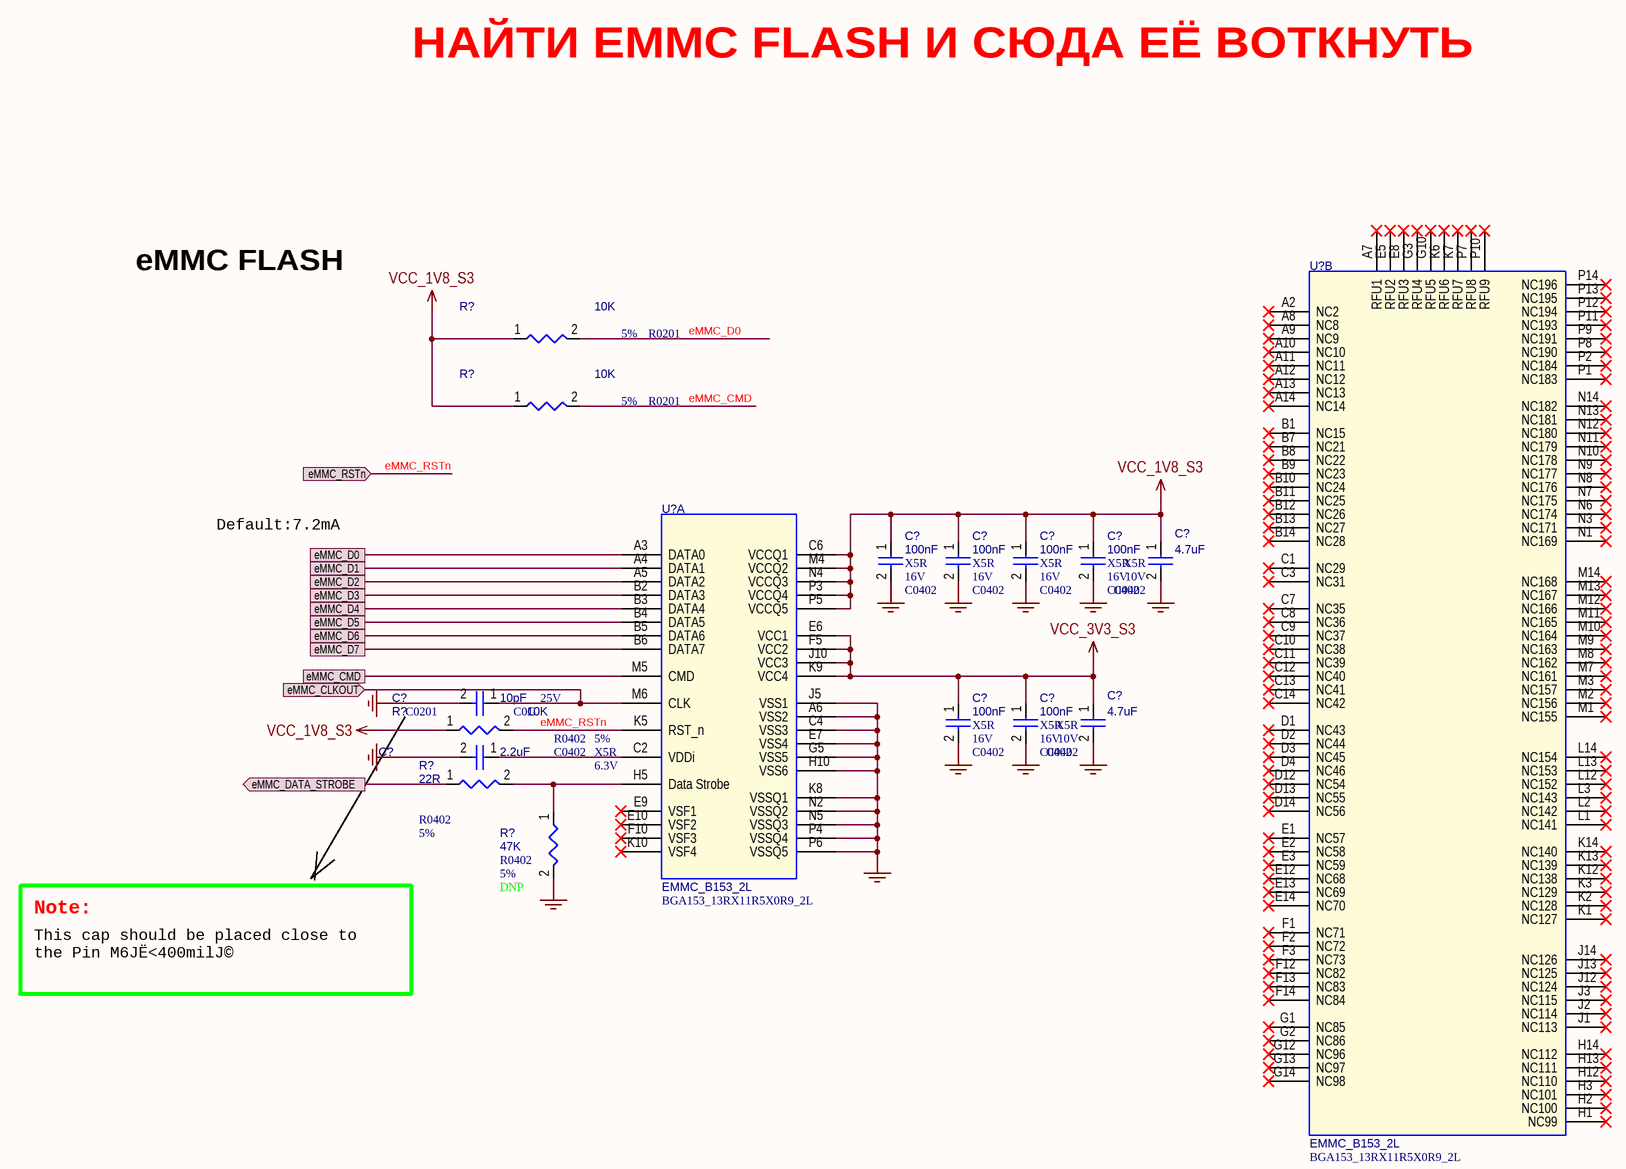
[diagram p19: FLASH_EMMC.SchDoc]

### Parts
(Parts that share a designator on the sheet are numbered #1, #2 ... from top to bottom, then left to right.)
C?#288  100nF  Dielectric: X5R  Voltage: 16V  [C0402]
C?#289  100nF  Dielectric: X5R  Voltage: 16V  [C0402]
C?#290  100nF  Dielectric: X5R  Voltage: 16V  [C0402]
C?#291  100nF  Dielectric: X5R  Voltage: 16V  [C0402]
C?#292  4.7uF  Dielectric: X5R  Voltage: 10V  [C0402]
C?#293  10pF  Dielectric: C0G  Voltage: 25V  [C0201]
C?#294  100nF  Dielectric: X5R  Voltage: 16V  [C0402]
C?#295  100nF  Dielectric: X5R  Voltage: 16V  [C0402]
C?#296  4.7uF  Dielectric: X5R  Voltage: 10V  [C0402]
C?#297  2.2uF  Dielectric: X5R  Voltage: 6.3V  [C0402]
R?#105  10K  Tolerance: 5%  PCB Footprint: R0201  [R0402]
R?#106  10K  Tolerance: 5%  PCB Footprint: R0201  [R0402]
R?#107  10K  Tolerance: 5%  [R0402]
R?#108  22R  Tolerance: 5%  [R0402]
R?#109  47K  Tolerance: 5%  option: DNP  [R0402]
U?#38  EMMC_B153_2L  [BGA153_13RX11R5X0R9_2L]  (part B of 2)
U?#39  EMMC_B153_2L  [BGA153_13RX11R5X0R9_2L]  (part A of 2)

### Ports
eMMC_CLKOUT (in, see RK3588_FLASH_SD_EMMC[3B]), eMMC_CMD (see RK3588_FLASH_SD_EMMC[3B]), eMMC_D0 (see RK3588_FLASH_SD_EMMC[3B]), eMMC_D1 (see RK3588_FLASH_SD_EMMC[3B]), eMMC_D2 (see RK3588_FLASH_SD_EMMC[3B]), eMMC_D3 (see RK3588_FLASH_SD_EMMC[3B]), eMMC_D4 (see RK3588_FLASH_SD_EMMC[3B]), eMMC_D5 (see RK3588_FLASH_SD_EMMC[3B]), eMMC_D6 (see RK3588_FLASH_SD_EMMC[3B]), eMMC_D7 (see RK3588_FLASH_SD_EMMC[3B]), eMMC_DATA_STROBE (out, see RK3588_FLASH_SD_EMMC[3B]), eMMC_RSTn (in, see RK3588_FLASH_SD_EMMC[3B])

### Nets
GND: C?#288.2 C?#289.2 C?#290.2 C?#291.2 C?#292.2 C?#293.2 C?#294.2 C?#295.2 C?#296.2 C?#297.2 R?#109.2 U?#39.A6(VSS2) U?#39.C4(VSS3) U?#39.E7(VSS4) U?#39.G5(VSS5) U?#39.H10(VSS6) U?#39.J5(VSS1) U?#39.K8(VSSQ1) U?#39.N2(VSSQ2) U?#39.N5(VSSQ3) U?#39.P4(VSSQ4) U?#39.P6(VSSQ5)
VCC_1V8_S3: C?#288.1 C?#289.1 C?#290.1 C?#291.1 C?#292.1 R?#105.1 R?#106.1 R?#107.1 U?#39.C6(VCCQ1) U?#39.M4(VCCQ2) U?#39.N4(VCCQ3) U?#39.P3(VCCQ4) U?#39.P5(VCCQ5)
VCC_3V3_S3: C?#294.1 C?#295.1 C?#296.1 U?#39.E6(VCC1) U?#39.F5(VCC2) U?#39.J10(VCC3) U?#39.K9(VCC4)
eMMC_CMD: R?#106.2
eMMC_D0: R?#105.2
eMMC_RSTn: R?#107.2 U?#39.K5(RST_n) ; port eMMC_RSTn
NetC?#293_1: C?#293.1 U?#39.M6(CLK) ; port eMMC_CLKOUT
NetC?#297_1: C?#297.1 U?#39.C2(VDDi)
NetR?#108_1: R?#108.1 ; port eMMC_DATA_STROBE
NetR?#108_2: R?#108.2 R?#109.1 U?#39.H5(Data_Strobe)
NetU?#5_AA32: U?#39.B4(DATA5) ; port eMMC_D5
NetU?#5_AA33: U?#39.B2(DATA3) ; port eMMC_D3
NetU?#5_V32: U?#39.A5(DATA2) ; port eMMC_D2
NetU?#5_V33: U?#39.B6(DATA7) ; port eMMC_D7
NetU?#5_W32: U?#39.B5(DATA6) ; port eMMC_D6
NetU?#5_W33: U?#39.A4(DATA1) ; port eMMC_D1
NetU?#5_W34: U?#39.M5(CMD) ; port eMMC_CMD
NetU?#5_Y32: U?#39.B3(DATA4) ; port eMMC_D4
NetU?#5_Y33: U?#39.A3(DATA0) ; port eMMC_D0

Not connected (* = marked no-connect by the designer): U?#38 A2(NC2)* A7(RFU1)* A8(NC8)* A9(NC9)* A10(NC10)* A11(NC11)* A12(NC12)* A13(NC13)* A14(NC14)* B1(NC15)* B7(NC21)* B8(NC22)* B9(NC23)* B10(NC24)* B11(NC25)* B12(NC26)* B13(NC27)* B14(NC28)* C1(NC29)* C3(NC31)* C7(NC35)* C8(NC36)* C9(NC37)* C10(NC38)* C11(NC39)* C12(NC40)* C13(NC41)* C14(NC42)* D1(NC43)* D2(NC44)* D3(NC45)* D4(NC46)* D12(NC54)* D13(NC55)* D14(NC56)* E1(NC57)* E2(NC58)* E3(NC59)* E5(RFU2)* E8(RFU3)* E12(NC68)* E13(NC69)* E14(NC70)* F1(NC71)* F2(NC72)* F3(NC73)* F12(NC82)* F13(NC83)* F14(NC84)* G1(NC85)* G2(NC86)* G3(RFU4)* G10(RFU5)* G12(NC96)* G13(NC97)* G14(NC98)* H1(NC99)* H2(NC100)* H3(NC101)* H12(NC110)* H13(NC111)* H14(NC112)* J1(NC113)* J2(NC114)* J3(NC115)* J12(NC124)* J13(NC125)* J14(NC126)* K1(NC127)* K2(NC128)* K3(NC129)* K6(RFU6)* K7(RFU7)* K12(NC138)* K13(NC139)* K14(NC140)* L1(NC141)* L2(NC142)* L3(NC143)* L12(NC152)* L13(NC153)* L14(NC154)* M1(NC155)* M2(NC156)* M3(NC157)* M7(NC161)* M8(NC162)* M9(NC163)* M10(NC164)* M11(NC165)* M12(NC166)* M13(NC167)* M14(NC168)* N1(NC169)* N3(NC171)* N6(NC174)* N7(NC175)* N8(NC176)* N9(NC177)* N10(NC178)* N11(NC179)* N12(NC180)* N13(NC181)* N14(NC182)* P1(NC183)* P2(NC184)* P7(RFU8)* P8(NC190)* P9(NC191)* P10(RFU9)* P11(NC193)* P12(NC194)* P13(NC195)* P14(NC196)*; U?#39 E9(VSF1)* E10(VSF2)* F10(VSF3)* K10(VSF4)*

### Notes on the sheet
- НАЙТИ EMMC FLASH И СЮДА ЕЁ ВОТКНУТЬ
- eMMC FLASH
- Default:7.2mA
- Note:
- This cap should be placed close to
  the Pin M6ЈЁ<400milЈ©
- 297x420
- Формат А3

### Library data of the parts
C?#288 = CAP NP_Dup1: cap,100.00nF,+/-10%,16V,X5R,C0402; Part Reference: C4000; Manufacturer: TDK; RK PN: C1005X5R1C104K050BA; Priority: A; Tolerance: 10%; PCB Footprint: C0402; Value: 100nF; Part Type: C0402; Manufacturer PN: C1005X5R1C104K050BA; Created by: JJJ
C?#289 = CAP NP_Dup1: cap,100.00nF,+/-10%,16V,X5R,C0402; Part Reference: C4001; Manufacturer PN: C1005X5R1C104K050BA; Manufacturer: TDK; Tolerance: 10%; Priority: A; PCB Footprint: C0402; Value: 100nF; Created by: JJJ; Part Type: C0402; RK PN: C1005X5R1C104K050BA
C?#290 = CAP NP_Dup1: cap,100.00nF,+/-10%,16V,X5R,C0402; Part Reference: C4002; Manufacturer PN: C1005X5R1C104K050BA; Manufacturer: TDK; Tolerance: 10%; Priority: A; PCB Footprint: C0402; Value: 100nF; Created by: JJJ; Part Type: C0402; RK PN: C1005X5R1C104K050BA
C?#291 = CAP NP_Dup1: cap,100.00nF,+/-10%,16V,X5R,C0402; Part Reference: C4003; Manufacturer: TDK; RK PN: C1005X5R1C104K050BA; Priority: A; Tolerance: 10%; PCB Footprint: C0402; Value: 100nF; Part Type: C0402; Manufacturer PN: C1005X5R1C104K050BA; Created by: JJJ
C?#292 = CAP NP_Dup1: cap,4.70uF,+/-10%,10V,X5R,C0402; Part Reference: C4004; Manufacturer: TDK; Number: 37; RK PN: C1005X5R1A475K050BC; Priority: A; Tolerance: 10%; C_Voltage: 6.3V; PCB Footprint: C0402; Value: 4.7uF; Part Type: C0402; Manufacturer PN: C1005X5R1A475K050BC; Created by: JJJ
C?#293 = CAP NP_Dup1: cap,10.00pF,+/-0.5,25V,C0G,C0201; Part Reference: C4005; Manufacturer: TDK; RK PN: C0603C0G1E100D030BA; Priority: A; Tolerance: +/-0.5pF; PCB Footprint: C0201; Value: 10pF; Part Type: C0201; Manufacturer PN: C0603C0G1E100D030BA; Created by: JJJ
C?#294 = CAP NP_Dup1: cap,100.00nF,+/-10%,16V,X5R,C0402; Part Reference: C4006; Manufacturer PN: C1005X5R1C104K050BA; Manufacturer: TDK; Tolerance: 10%; Priority: A; PCB Footprint: C0402; Value: 100nF; Created by: JJJ; Part Type: C0402; RK PN: C1005X5R1C104K050BA
C?#295 = CAP NP_Dup1: cap,100.00nF,+/-10%,16V,X5R,C0402; Part Reference: C4007; Manufacturer PN: C1005X5R1C104K050BA; Manufacturer: TDK; Tolerance: 10%; Priority: A; PCB Footprint: C0402; Value: 100nF; Created by: JJJ; Part Type: C0402; RK PN: C1005X5R1C104K050BA
C?#296 = CAP NP_Dup1: cap,4.70uF,+/-10%,10V,X5R,C0402; Part Reference: C4008; Manufacturer: TDK; Number: 37; RK PN: C1005X5R1A475K050BC; Priority: A; Tolerance: 10%; C_Voltage: 6.3V; PCB Footprint: C0402; Value: 4.7uF; Part Type: C0402; Manufacturer PN: C1005X5R1A475K050BC; Created by: JJJ
C?#297 = CAP NP_Dup1: cap,2.20uF,+/-10%,6.3V,X5R,C0402; Part Reference: C4009; Manufacturer: TDK; RK PN: C1005X5R0J225K050BC; Priority: A; Tolerance: 10%; PCB Footprint: C0402; Value: 2.2uF; Part Type: C0402; Manufacturer PN: C1005X5R0J225K050BC; Created by: JJJ
R?#105 = RESISTOR_Dup2: НЁУГєсД¤µзЧи,10K,+/-5%,R0201,1/20W.; Part Reference: R4001; Manufacturer: YAGEO; RK PN: RC0201JR-0710KL; Priority: A; Wattage: 1/20W; Value: 10K; Part Type: НЁУГєсД¤µзЧи; Manufacturer PN: RC0201JR-0710KL; Created by: YTL
R?#106 = RESISTOR_Dup2: НЁУГєсД¤µзЧи,10K,+/-5%,R0201,1/20W.; Part Reference: R4000; Manufacturer: YAGEO; RK PN: RC0201JR-0710KL; Priority: A; Wattage: 1/20W; Value: 10K; Part Type: НЁУГєсД¤µзЧи; Manufacturer PN: RC0201JR-0710KL; Created by: YTL
R?#107 = RESISTOR_Dup2: НЁУГєсД¤µзЧи,10K,+/-5%,R0402,1/16W.; Part Reference: R4002; Manufacturer PN: RC0402JR-0710KL; Manufacturer: YAGEO; Wattage: 1/16W; Priority: A; PCB Footprint: R0402; Value: 10K; Created by: YTL; Part Type: НЁУГєсД¤µзЧи; RK PN: RC0402JR-0710KL
R?#108 = RESISTOR_Dup2: НЁУГєсД¤µзЧи,22R,+/-5%,R0402,1/16W.; Part Reference: R4003; Manufacturer PN: RC0402JR-0722RL; Manufacturer: YAGEO; Wattage: 1/16W; Priority: A; PCB Footprint: R0402; Value: 22R; Created by: YTL; Part Type: НЁУГєсД¤µзЧи; RK PN: RC0402JR-0722RL
R?#109 = RESISTOR_Dup2: НЁУГєсД¤µзЧи,47K,+/-5%,R0402,1/16W.; Part Reference: R4004; Manufacturer: YAGEO; RK PN: RC0402JR-0747KL; Priority: A; Wattage: 1/16W; PCB Footprint: R0402; Value: 47K; Part Type: НЁУГєсД¤µзЧи; Manufacturer PN: RC0402JR-0747KL; Created by: YTL
U?#38 U?#39 = INAND_EMMC_153_2L: EMMC_B153_2L,ёьєГµДВъЧг№¤ТХРиЗуЈ¬Fanout·ЅКЅІї·ЦЧЯПЯїзЅУФЩЗтО»ЙПЈ¬НЪіэA1\C5ЗтО»; Part Reference: U4000; Priority: A; PCB Footprint: BGA153_13RX11R5X0R9_2L; Value: EMMC_B153_2L; Created by: YWQ; Part Type: NAND_FLASH; RK PN: EMMC_B153_2L

## Sheet FLASH_SD_CARD.SchDoc
size 420 x 297 mm; SheetNumber: 18; SheetTotal: 23
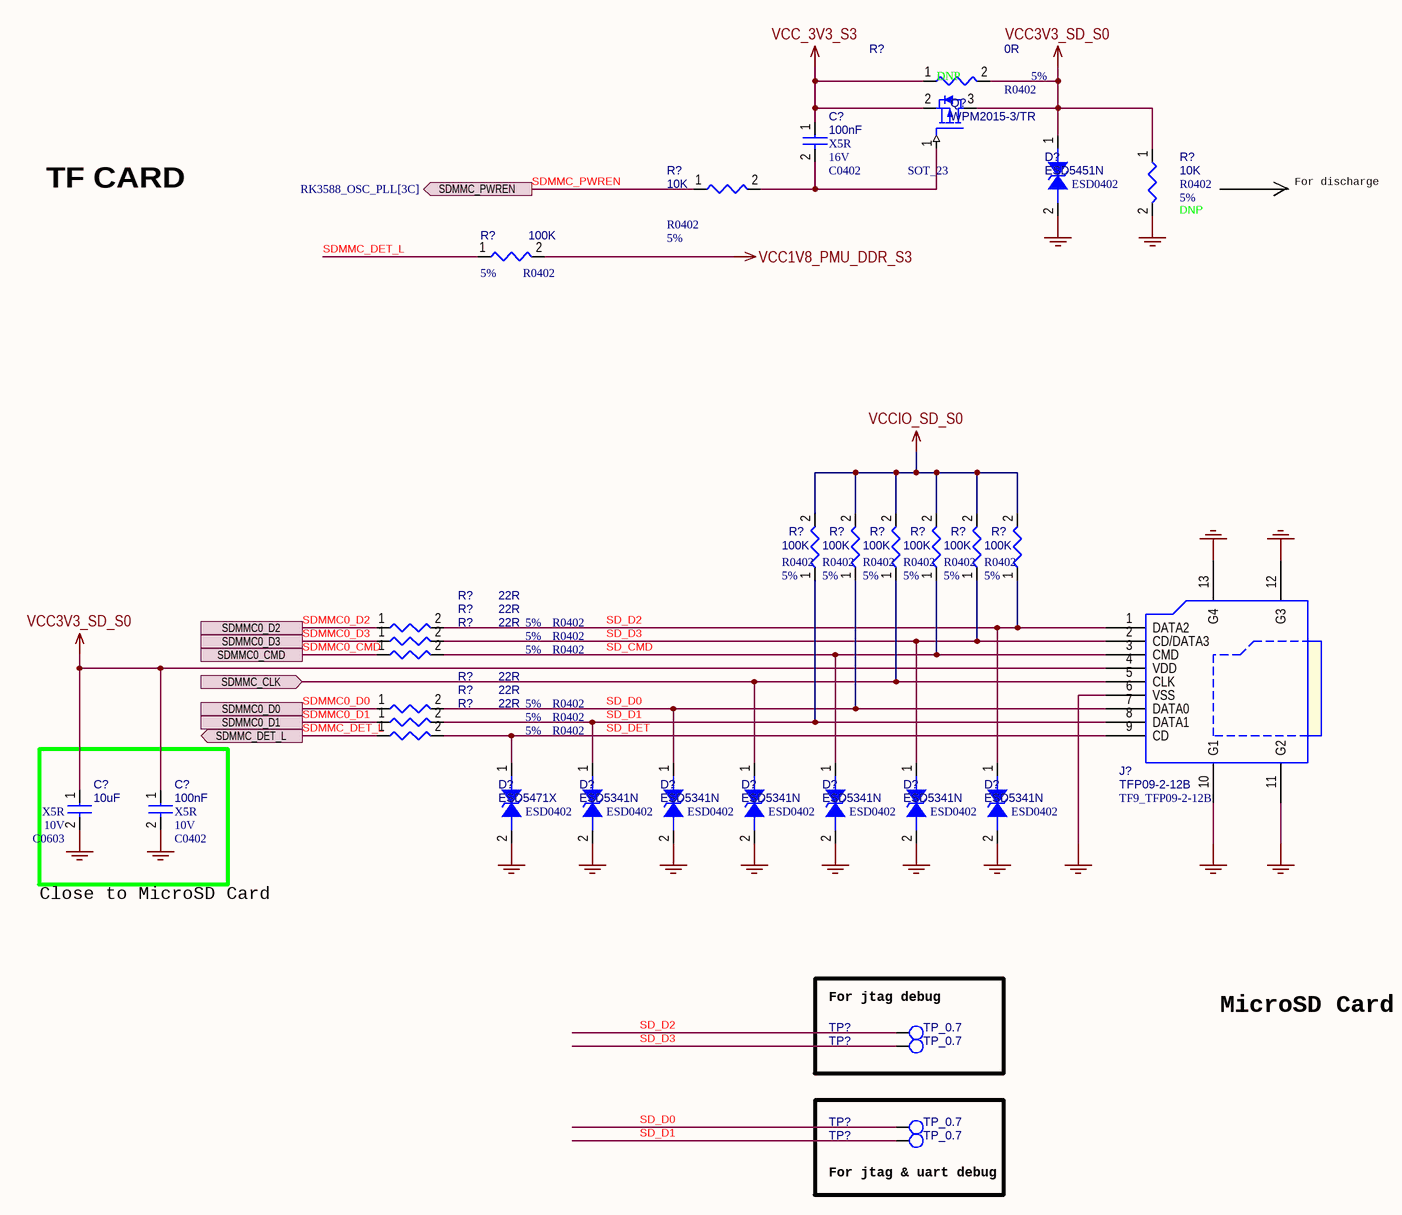
[diagram p20: FLASH_SD_CARD.SchDoc]

### Parts
(Parts that share a designator on the sheet are numbered #1, #2 ... from top to bottom, then left to right.)
C?#298  100nF  Dielectric: X5R  Voltage: 16V  [C0402]
C?#299  10uF  Dielectric: X5R  Voltage: 10V  [C0603]
C?#300  100nF  Dielectric: X5R  Voltage: 10V  [C0402]
D?#2  ESD5451N  [ESD0402]
D?#3  ESD5471X  [ESD0402]
D?#4  ESD5341N  [ESD0402]
D?#5  ESD5341N  [ESD0402]
D?#6  ESD5341N  [ESD0402]
D?#7  ESD5341N  [ESD0402]
D?#8  ESD5341N  [ESD0402]
D?#9  ESD5341N  [ESD0402]
J?#4  TFP09-2-12B  PCB Footprint: TF9_TFP09-2-12B  [TF-CKT01-009D]
Q?#1  WPM2015-3/TR  PCB Footprint: SOT_23  [SOT23]
R?#110  0R  Tolerance: 5%  option: DNP  [R0402]
R?#111  10K  Tolerance: 5%  option: DNP  [R0402]
R?#112  10K  Tolerance: 5%  [R0402]
R?#113  100K  Tolerance: 5%  [R0402]
R?#114  100K  Tolerance: 5%  [R0402]
R?#115  100K  Tolerance: 5%  [R0402]
R?#116  100K  Tolerance: 5%  [R0402]
R?#117  100K  Tolerance: 5%  [R0402]
R?#118  100K  Tolerance: 5%  [R0402]
R?#119  100K  Tolerance: 5%  [R0402]
R?#120  22R  Tolerance: 5%  [R0402]
R?#121  22R  Tolerance: 5%  [R0402]
R?#122  22R  Tolerance: 5%  [R0402]
R?#123  22R  Tolerance: 5%  [R0402]
R?#124  22R  Tolerance: 5%  [R0402]
R?#125  22R  Tolerance: 5%  [R0402]
TP?#1  TP_0.7  [TEST]
TP?#2  TP_0.7  [TEST]
TP?#3  TP_0.7  [TEST]
TP?#4  TP_0.7  [TEST]

### Blocks framed on the sheet
For jtag debug: TP?#1 TP?#2
For jtag & uart debug: TP?#3 TP?#4

### Ports
SDMMC0_CMD (see RK3588_FLASH_SD_EMMC[4C]), SDMMC0_D0 (see RK3588_FLASH_SD_EMMC[4C]), SDMMC0_D1 (see RK3588_FLASH_SD_EMMC[4C]), SDMMC0_D2 (see RK3588_FLASH_SD_EMMC[4C]), SDMMC0_D3 (see RK3588_FLASH_SD_EMMC[4C]), SDMMC_CLK (in, see RK3588_FLASH_SD_EMMC[4C]), SDMMC_DET_L (out, see RK3588_OSC_PLL[4B]), SDMMC_PWREN (out, see RK3588_OSC_PLL[3C])

### Nets
GND: C?#299.2 C?#300.2 D?#2.2 D?#3.2 D?#4.2 D?#5.2 D?#6.2 D?#7.2 D?#8.2 D?#9.2 J?#4.6(VSS) J?#4.10(G1) J?#4.11(G2) J?#4.12(G3) J?#4.13(G4) R?#111.2
VCC1V8_PMU_DDR_S3: R?#113.2
VCC3V3_SD_S0: C?#299.1 C?#300.1 D?#2.1 J?#4.4(VDD) Q?#1.3(DRAIN) R?#110.2 R?#111.1
VCC_3V3_S3: C?#298.1 Q?#1.2(SOURCE) R?#110.1
VCCIO_SD_S0: R?#114.2 R?#115.2 R?#116.2 R?#117.2 R?#118.2 R?#119.2
SD_CMD: D?#7.1 J?#4.3(CMD) R?#117.1 R?#122.2
SD_D0: D?#5.1 J?#4.7(DATA0) R?#115.1 R?#123.2 TP?#3.1
SD_D1: D?#4.1 J?#4.8(DATA1) R?#114.1 R?#124.2 TP?#4.1
SD_D2: D?#9.1 J?#4.1(DATA2) R?#119.1 R?#120.2 TP?#1.1
SD_D3: D?#8.1 J?#4.2(CD/DATA3) R?#118.1 R?#121.2 TP?#2.1
SD_DET: D?#3.1 J?#4.9(CD) R?#125.2
SDMMC0_CMD: R?#122.1 ; port SDMMC0_CMD
SDMMC0_D0: R?#123.1 ; port SDMMC0_D0
SDMMC0_D1: R?#124.1 ; port SDMMC0_D1
SDMMC0_D2: R?#120.1 ; port SDMMC0_D2
SDMMC0_D3: R?#121.1 ; port SDMMC0_D3
SDMMC_DET_L: R?#113.1 R?#125.1 ; port SDMMC_DET_L
SDMMC_PWREN: R?#112.1 ; port SDMMC_PWREN
NetC?#298_2: C?#298.2 Q?#1.1(GATE) R?#112.2
NetD?#6_1: D?#6.1 J?#4.5(CLK) R?#116.1 ; port SDMMC_CLK

### Notes on the sheet
- For discharge
- TF CARD
- Close to MicroSD Card
- MicroSD Card
- 297x420
- Формат А3

### Library data of the parts
C?#298 = CAP NP_Dup1: cap,100.00nF,+/-10%,16V,X5R,C0402; Part Reference: C4200; Manufacturer: TDK; Number: 37; RK PN: C1005X5R1C104K050BA; Priority: A; Tolerance: 10%; C_Voltage: 6.3V; PCB Footprint: C0402; Value: 100nF; Part Type: C0402; Manufacturer PN: C1005X5R1C104K050BA; Created by: JJJ
C?#299 = CAP NP_Dup1: cap,10.00uF,+/-10%,10V,X5R,C0603; Part Reference: C4201; Manufacturer PN: C1608X5R1A106K080AC; Manufacturer: TDK; Tolerance: 10%; C_Voltage: 6.3V; Priority: A; PCB Footprint: C0603; Value: 10uF; Created by: JJJ; Part Type: C0603; RK PN: C1608X5R1A106K080AC
C?#300 = CAP NP_Dup1: cap,100.00nF,+/-10%,10V,X5R,C0402; Part Reference: C4202; Manufacturer PN: C1005X5R1A104K050BA; Manufacturer: TDK; C_Voltage: 6.3V; Tolerance: 10%; Priority: A; Number: 37; PCB Footprint: C0402; Value: 100nF; Created by: JJJ; Part Type: C0402; RK PN: C1005X5R1A104K050BA
D?#2 = DIODE BI_DIR TRIG: 1-Line, Bi-directional, Transient Voltage Suppressors.17.5pF.; Part Reference: D4200; Manufacturer: WillSemi(О¤¶ы°лµјМе); Priority: A; PCB Footprint: ESD0402; Value: ESD5451N; RK PN: ESD5451N; Part Type: ESD_TVS; Manufacturer PN: ESD5451N; Created by: JJJ
D?#3 = DIODE BI_DIR TRIG: 1-Line, Bi-directional, Transient Voltage Suppressors.9pF.; Part Reference: D4201; Manufacturer: WillSemi(О¤¶ы°лµјМе); Priority: A; PCB Footprint: ESD0402; Value: ESD5471X; Created by: JJJ; Manufacturer PN: ESD5471X; Part Type: ESD_TVS; RK PN: ESD5471X
D?#4 = DIODE BI_DIR TRIG: 1-Line, Bi-directional, Transient Voltage Suppressors.1pF.; Part Reference: D4202; Manufacturer: WillSemi(О¤¶ы°лµјМе); Priority: A; PCB Footprint: ESD0402; Value: ESD5341N; Created by: JJJ; Manufacturer PN: ESD5341N; Part Type: ESD_TVS; RK PN: ESD5341N
D?#5 = DIODE BI_DIR TRIG: 1-Line, Bi-directional, Transient Voltage Suppressors.1pF.; Part Reference: D4203; Manufacturer: WillSemi(О¤¶ы°лµјМе); Priority: A; PCB Footprint: ESD0402; Value: ESD5341N; Created by: JJJ; Manufacturer PN: ESD5341N; Part Type: ESD_TVS; RK PN: ESD5341N
D?#6 = DIODE BI_DIR TRIG: 1-Line, Bi-directional, Transient Voltage Suppressors.1pF.; Part Reference: D4204; Manufacturer: WillSemi(О¤¶ы°лµјМе); Priority: A; PCB Footprint: ESD0402; Value: ESD5341N; RK PN: ESD5341N; Part Type: ESD_TVS; Manufacturer PN: ESD5341N; Created by: JJJ
D?#7 = DIODE BI_DIR TRIG: 1-Line, Bi-directional, Transient Voltage Suppressors.1pF.; Part Reference: D4205; Manufacturer: WillSemi(О¤¶ы°лµјМе); Priority: A; PCB Footprint: ESD0402; Value: ESD5341N; RK PN: ESD5341N; Part Type: ESD_TVS; Manufacturer PN: ESD5341N; Created by: JJJ
D?#8 = DIODE BI_DIR TRIG: 1-Line, Bi-directional, Transient Voltage Suppressors.1pF.; Part Reference: D4206; Manufacturer: WillSemi(О¤¶ы°лµјМе); Priority: A; PCB Footprint: ESD0402; Value: ESD5341N; RK PN: ESD5341N; Part Type: ESD_TVS; Manufacturer PN: ESD5341N; Created by: JJJ
D?#9 = DIODE BI_DIR TRIG: 1-Line, Bi-directional, Transient Voltage Suppressors.1pF.; Part Reference: D4207; Manufacturer: WillSemi(О¤¶ы°лµјМе); Priority: A; PCB Footprint: ESD0402; Value: ESD5341N; RK PN: ESD5341N; Part Type: ESD_TVS; Manufacturer PN: ESD5341N; Created by: JJJ
J?#4 = TFCARD_SOCKET: НЁУГTFїЁЧщЈ¬И«іЯґз; Part Reference: J4200; Manufacturer: НъїЖґп; Priority: A; Value: TFP09-2-12B; Created by: JJJ; Manufacturer Part Number: TFP09-2-12B; Part Type: CARD Jack; RK PN: TFP09-2-12B
Q?#1 = MOSFET P: PMOS,WPM2015-3/TR,SOT_23,Id=2.4A,Vds=20V; Part Reference: Q4200; Manufacturer: WillSemi(О¤¶ы°лµјМе); ROOM: CHG; Priority: A; Id_max: 2.4A; Vgs: ЎА8V; VDS: 20V; Vgsth: 0.62V; Pd: 0.5W; Value: WPM2015-3/TR; RK PN: WPM2015-3/TR; Part Type: PMOS; Manufacturer PN: WPM2015-3/TR; Created by: JJJ
R?#110 = RESISTOR_Dup2: НЁУГєсД¤µзЧи,0R,+/-5%,R0402,1/16W.; Part Reference: R4200; Manufacturer: YAGEO; RK PN: RC0402JR-070RL; Priority: A; Wattage: 1/16W; PCB Footprint: R0402; Value: 0R; Part Type: НЁУГєсД¤µзЧи; Manufacturer PN: RC0402JR-070RL; Created by: YTL
R?#111 = RESISTOR_Dup2: НЁУГєсД¤µзЧи,10K,+/-5%,R0402,1/16W.; Part Reference: R4202; Manufacturer PN: RC0402JR-0710KL; Manufacturer: YAGEO; Wattage: 1/16W; Priority: A; PCB Footprint: R0402; Value: 10K; Created by: YTL; Part Type: НЁУГєсД¤µзЧи; RK PN: RC0402JR-0710KL
R?#112 = RESISTOR_Dup2: НЁУГєсД¤µзЧи,10K,+/-5%,R0402,1/16W.; Part Reference: R4201; Manufacturer PN: RC0402JR-0710KL; Manufacturer: YAGEO; Wattage: 1/16W; Priority: A; PCB Footprint: R0402; Value: 10K; Created by: YTL; Part Type: НЁУГєсД¤µзЧи; RK PN: RC0402JR-0710KL
R?#113-R?#119 = RESISTOR_Dup2: НЁУГєсД¤µзЧи,100K,+/-5%,R0402,1/16W.; Part Reference: R4203; Manufacturer: YAGEO; RK PN: RC0402JR-07100KL; Priority: A; Wattage: 1/16W; PCB Footprint: R0402; Value: 100K; Part Type: НЁУГєсД¤µзЧи; Manufacturer PN: RC0402JR-07100KL; Created by: YTL
R?#120 = RESISTOR_Dup2: НЁУГєсД¤µзЧи,22R,+/-5%,R0402,1/16W.; Part Reference: R4204; Manufacturer: YAGEO; RK PN: RC0402JR-0722RL; Priority: A; Wattage: 1/16W; PCB Footprint: R0402; Value: 22R; Part Type: НЁУГєсД¤µзЧи; Manufacturer PN: RC0402JR-0722RL; Created by: YTL
R?#121 = RESISTOR_Dup2: НЁУГєсД¤µзЧи,22R,+/-5%,R0402,1/16W.; Part Reference: R4205; Manufacturer: YAGEO; RK PN: RC0402JR-0722RL; Priority: A; Wattage: 1/16W; PCB Footprint: R0402; Value: 22R; Part Type: НЁУГєсД¤µзЧи; Manufacturer PN: RC0402JR-0722RL; Created by: YTL
R?#122 = RESISTOR_Dup2: НЁУГєсД¤µзЧи,22R,+/-5%,R0402,1/16W.; Part Reference: R4206; Manufacturer: YAGEO; RK PN: RC0402JR-0722RL; Priority: A; Wattage: 1/16W; PCB Footprint: R0402; Value: 22R; Part Type: НЁУГєсД¤µзЧи; Manufacturer PN: RC0402JR-0722RL; Created by: YTL
R?#123 = RESISTOR_Dup2: НЁУГєсД¤µзЧи,22R,+/-5%,R0402,1/16W.; Part Reference: R4207; Manufacturer PN: RC0402JR-0722RL; Manufacturer: YAGEO; Wattage: 1/16W; Priority: A; PCB Footprint: R0402; Value: 22R; Created by: YTL; Part Type: НЁУГєсД¤µзЧи; RK PN: RC0402JR-0722RL
R?#124 = RESISTOR_Dup2: НЁУГєсД¤µзЧи,22R,+/-5%,R0402,1/16W.; Part Reference: R4208; Manufacturer PN: RC0402JR-0722RL; Manufacturer: YAGEO; Wattage: 1/16W; Priority: A; PCB Footprint: R0402; Value: 22R; Created by: YTL; Part Type: НЁУГєсД¤µзЧи; RK PN: RC0402JR-0722RL
R?#125 = RESISTOR_Dup2: НЁУГєсД¤µзЧи,22R,+/-5%,R0402,1/16W.; Part Reference: R4209; Manufacturer PN: RC0402JR-0722RL; Manufacturer: YAGEO; Wattage: 1/16W; Priority: A; PCB Footprint: R0402; Value: 22R; Created by: YTL; Part Type: НЁУГєсД¤µзЧи; RK PN: RC0402JR-0722RL
TP?#1 = TP: Test Point 0.7mm; Part Reference: TP4200; PCB Footprint: TP_0R70; Priority: A; RK PN: TESTPOINT_0R7; Value: TP_0.7; Created by: JJJ; Part Type: TP
TP?#2 = TP: Test Point 0.7mm; Part Reference: TP4201; PCB Footprint: TP_0R70; RK PN: TESTPOINT_0R7; Priority: A; Value: TP_0.7; Part Type: TP; Created by: JJJ
TP?#3 = TP: Test Point 0.7mm; Part Reference: TP4202; PCB Footprint: TP_0R70; Priority: A; RK PN: TESTPOINT_0R7; Value: TP_0.7; Created by: JJJ; Part Type: TP
TP?#4 = TP: Test Point 0.7mm; Part Reference: TP4203; PCB Footprint: TP_0R70; Priority: A; RK PN: TESTPOINT_0R7; Value: TP_0.7; Created by: JJJ; Part Type: TP